# EAGLE design Irrigation Shield v3 (EAGLE 6.4)
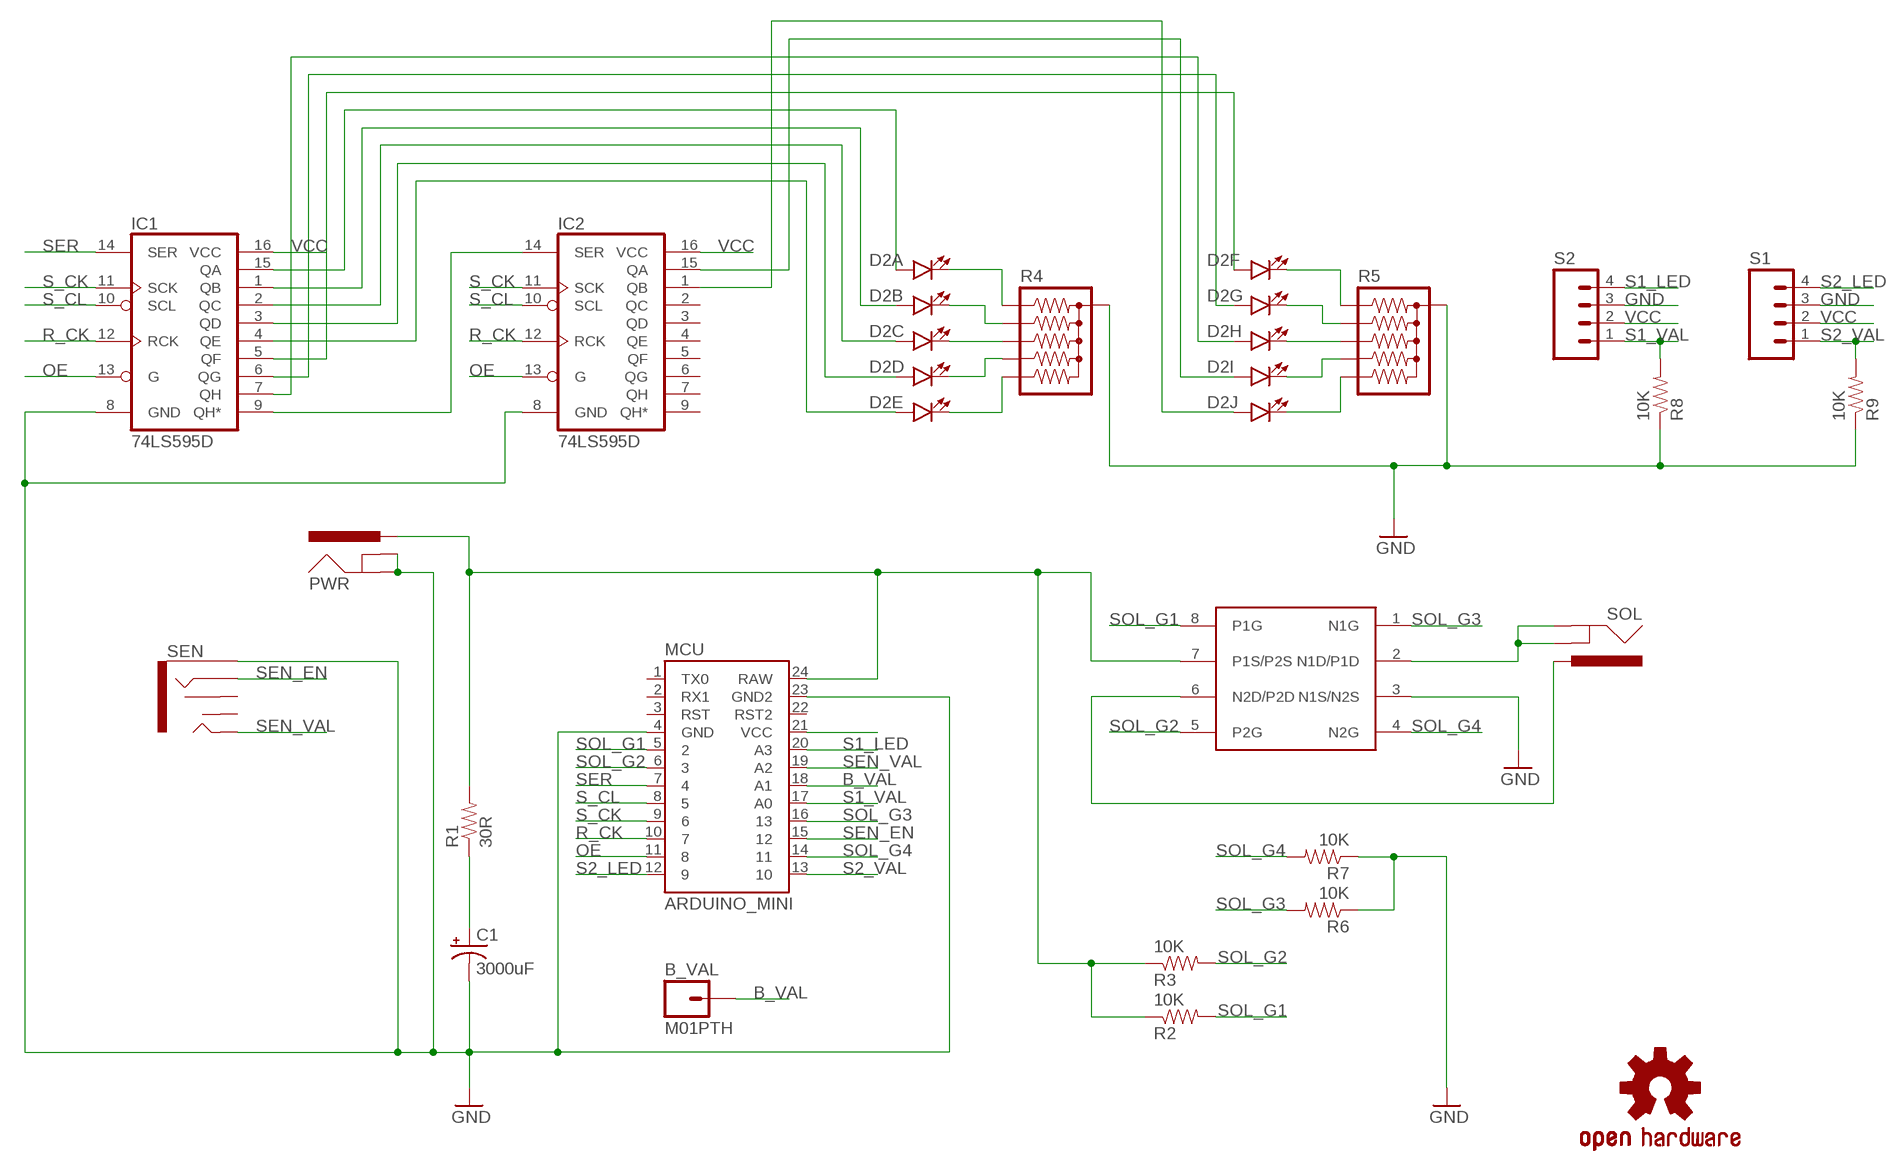
[diagram p0: schematic, sheet 1]

## Parts
B_VAL  M01PTH  [1X01]
C1  3000uF  CAP_POLPTH3  [CPOL-RADIAL-1000UF-63V]
D2  LED_BARGRAPH_10  [LED_BARGAPH_10]
IC1  74LS595D  [SO16]
IC2  74LS595D  [SO16]
LOGO1  OSHW-LOGOL  [OSHW-LOGO-L]
MCU  ARDUINO_MINI  [ARDUINO_MINI]
PWR  POWER_JACKPTH  [POWER_JACK_PTH]
R1  30R  RESISTOR0603-RES  [0603-RES]
R2  10K  RESISTOR0603-RES  [0603-RES]
R3  10K  RESISTOR0603-RES  [0603-RES]
R4  RPACK-BUSSED-SIP-PTH-5  [RPACK-SIP-PTH-5]
R5  RPACK-BUSSED-SIP-PTH-5  [RPACK-SIP-PTH-5]
R6  10K  RESISTOR0603-RES  [0603-RES]
R7  10K  RESISTOR0603-RES  [0603-RES]
R8  10K  RESISTOR0603-RES  [0603-RES]
R9  10K  RESISTOR0603-RES  [0603-RES]
S1  M04PTH  [1X04]
S2  M04PTH  [1X04]
SEN  AUDIO-JACK2PTH  [AUDIO-JACK]
SOL  POWER_JACKPTH  [POWER_JACK_PTH]
U$1  ZXMHC6A07N8  [SO8]

## Nets
B_VAL: B_VAL.1 MCU.18(A1)
GND: C1.2(-) IC1.8(GND) IC2.8(GND) MCU.4(GND) MCU.23(GND2) PWR.GND PWR.GNDBREAK R4.P$1 R5.P$1 R6.1 R7.1 R8.1 R9.1 S1.3 S2.3 SEN.SLEEVE U$1.3(N1S/N2S)
N$1: SOL.GND SOL.GNDBREAK U$1.2(N1D/P1D)
N$2: SOL.PWR U$1.6(N2D/P2D)
N$3: IC1.9(QH*) IC2.14(SER)
N$5: D2.7(G:A) IC1.6(QG)
N$7: MCU.24(RAW) PWR.PWR R1.2 R2.1 R3.1 U$1.7(P1S/P2S)
N$8: C1.1(+) R1.1
N$10: D2.15(F:C) R5.P$2
N$11: D2.14(G:C) R5.P$3
N$12: D2.13(H:C) R5.P$4
N$13: D2.12(I:C) R5.P$5
N$14: D2.11(J:C) R5.P$6
N$15: D2.16(E:C) R4.P$6
N$16: D2.17(D:C) R4.P$5
N$17: D2.18(C:C) R4.P$4
N$18: D2.19(B:C) R4.P$3
N$19: D2.20(A:C) R4.P$2
N$20: D2.1(A:A) IC1.15(QA)
N$21: D2.2(B:A) IC1.1(QB)
N$22: D2.3(C:A) IC1.2(QC)
N$23: D2.4(D:A) IC1.3(QD)
N$24: D2.5(E:A) IC1.4(QE)
N$25: D2.6(F:A) IC1.5(QF)
N$26: D2.8(H:A) IC1.7(QH)
N$27: D2.9(I:A) IC2.15(QA)
N$28: D2.10(J:A) IC2.1(QB)
OE: IC1.13(G) IC2.13(G) MCU.11
R_CK: IC1.12(RCK) IC2.12(RCK) MCU.10
S1_LED: MCU.20(A3) S2.4
S1_VAL: MCU.17(A0) R8.2 S2.1
S2_LED: MCU.12 S1.4
S2_VAL: MCU.13 R9.2 S1.1
S_CK: IC1.11(SCK) IC2.11(SCK) MCU.9
S_CL: IC1.10(SCL) IC2.10(SCL) MCU.8
SEN_EN: MCU.15 SEN.RING
SEN_VAL: MCU.19(A2) SEN.TIP
SER: IC1.14(SER) MCU.7
SOL_G1: MCU.5 R2.2 U$1.8(P1G)
SOL_G2: MCU.6 R3.2 U$1.5(P2G)
SOL_G3: MCU.16 R6.2 U$1.1(N1G)
SOL_G4: MCU.14 R7.2 U$1.4(N2G)
VCC: IC1.16(VCC) IC2.16(VCC) MCU.21(VCC) S1.2 S2.2
Unconnected: IC2.2(QC) IC2.3(QD) IC2.4(QE) IC2.5(QF) IC2.6(QG) IC2.7(QH) IC2.9(QH*) MCU.1(TX0) MCU.2(RX1) MCU.3(RST) MCU.22(RST2) SEN.RSH SEN.TSH

## Library data of the parts
B_VAL = SparkFun-Connectors:M01: Header 1 Standard 1-pin 0.1" header. Use with straight break away headers (SKU : PRT-00116), right angle break away headers (PRT-00553), swiss pins (PRT-00743), machine pins (PRT-00117), and female headers (PRT-00115).
C1 = SparkFun-Capacitors:CAP_POL: Capacitor Polarized These are standard SMD and PTH capacitors. Normally 10uF, 47uF, and 100uF in electrolytic and tantalum varieties. Always verify the external diameter of the through hole cap, it varies with capacity, voltage, and manufacturer. The EIA devices should be standard.
D2 = SparkFun-LED:LED_BARGRAPH_10: 10-Segment LED Bar Graph SFE part numbers: COM-09935 (red, Vf = 2.1V, Ifmax = 20mA) COM-09936 (yellow, Vf = 2.1V, Ifmax = 20mA) COM-09937 (blue, Vf = 3.4V, Ifmax = 20mA) COM-09938 (green, Vf = 3.4V, Ifmax = 20mA)
IC1 IC2 = SparkFun-DigitalIC:74*595: 8-bit SHIFT REGISTER, output latch
LOGO1 = SparkFun-Aesthetics:OSHW-LOGO: Open Source Hardware Logo This logo indicates the piece of hardware it is found on incorporates a OSHW license and/or adheres to the definition of open source hardware found here: http://freedomdefined.org/OSHW
MCU = SparkFun-Boards:ARDUINO_MINI: Arduino Pro Mini footprint
PWR = SparkFun-Connectors:POWER_JACK: Power Jack This is the standard 5.5mm barrel jack for power. The PTH is the most common, proven, reliable, footprint. The Slot footprint only works if the mill layer is transmitted to the PCB fab house so be warned. Spark Fun Electronics SKU : PRT-00119 SMT: CONN-08106 Mating wall wart : TOL-00298 (and others)
R1-R3 R6-R9 = SparkFun-Resistors:RESISTOR: Resistor Basic schematic elements and footprints for 0603, 1206, and PTH resistors.
R4 R5 = SparkFun-Resistors:RPACK: BOURNS 4600X series thick-film SIP resistor packs Five resistors bussed to a single pin (denoted by dot). 0.2W / resistor datasheet <http://dlnmh9ip6v2uc.cloudfront.net/datasheets/Components/General/4600x.pdf> SFE parts COM-10855 (330), COM-10856 (10K)
S1 S2 = SparkFun-Connectors:M04: Header 4 Standard 4-pin 0.1" header. Use with straight break away headers (SKU : PRT-00116), right angle break away headers (PRT-00553), swiss pins (PRT-00743), machine pins (PRT-00117), and female headers (PRT-00115). Molex polarized connector foot print use with SKU : PRT-08231 with associated crimp pins and housings. 1MM SMD Version SKU: PRT-10208
SEN = SparkFun-Connectors:AUDIO-JACK2: Stereo audio jack with bypass switches. Used on LilyPad MP3 board. Production SKU: CONN-10353
SOL = SparkFun:POWER_JACK: Power Jack This is the standard 5.5mm barrel jack for power. The PTH is the most common, proven, reliable, footprint. All others are experimental. The Slot footprint only works if the mill layer is transmitted to the PCB fab house so be warned. Spark Fun Electronics SKU : PRT-00119. Mating wall wart : TOL-00298 (and others)
U$1 = Hbridge2:ZXMHC6A07N8

## Board
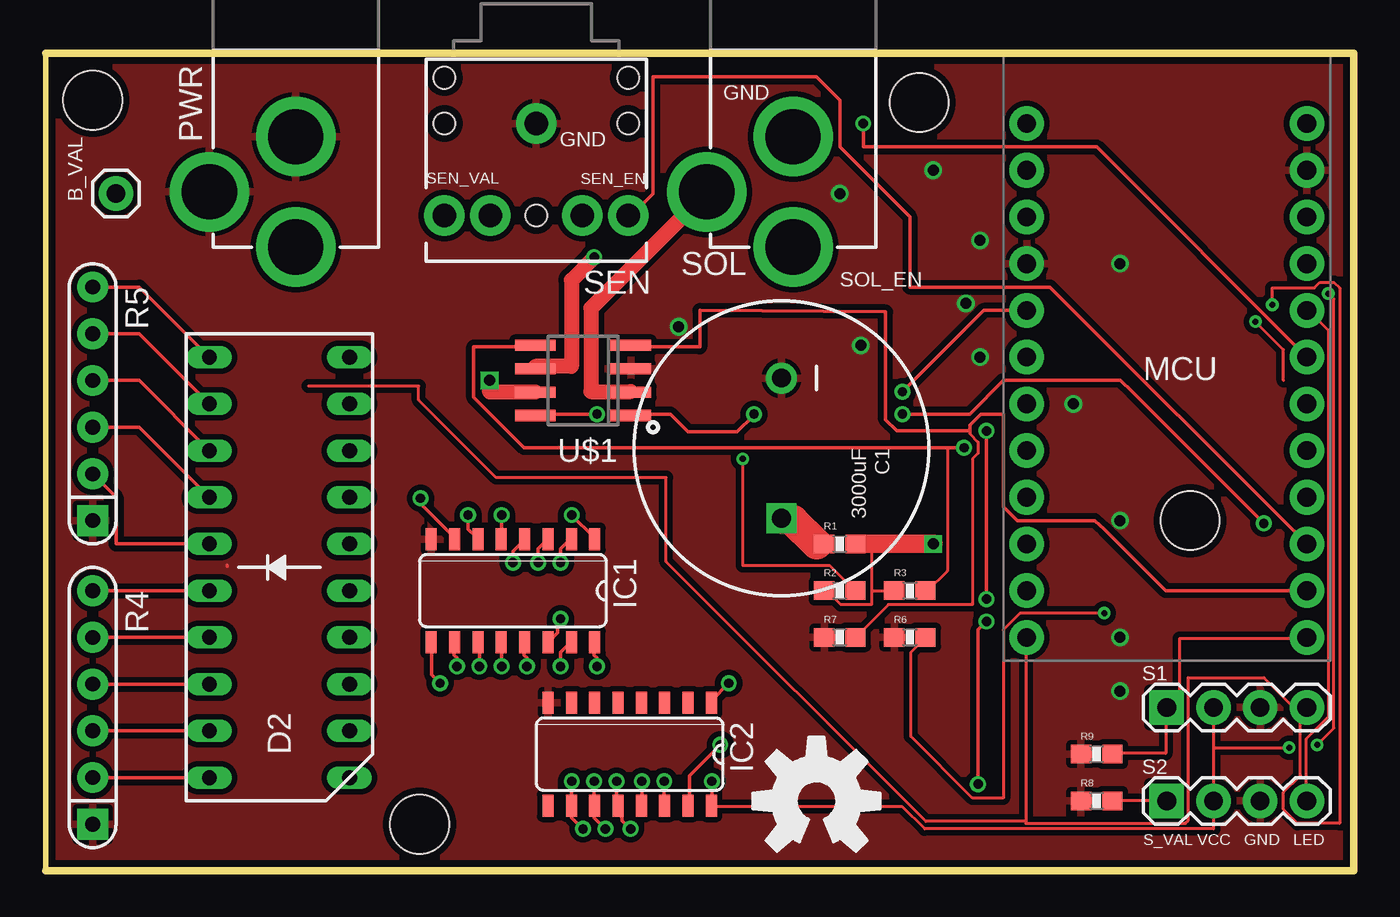
[diagram p1: board, top side]
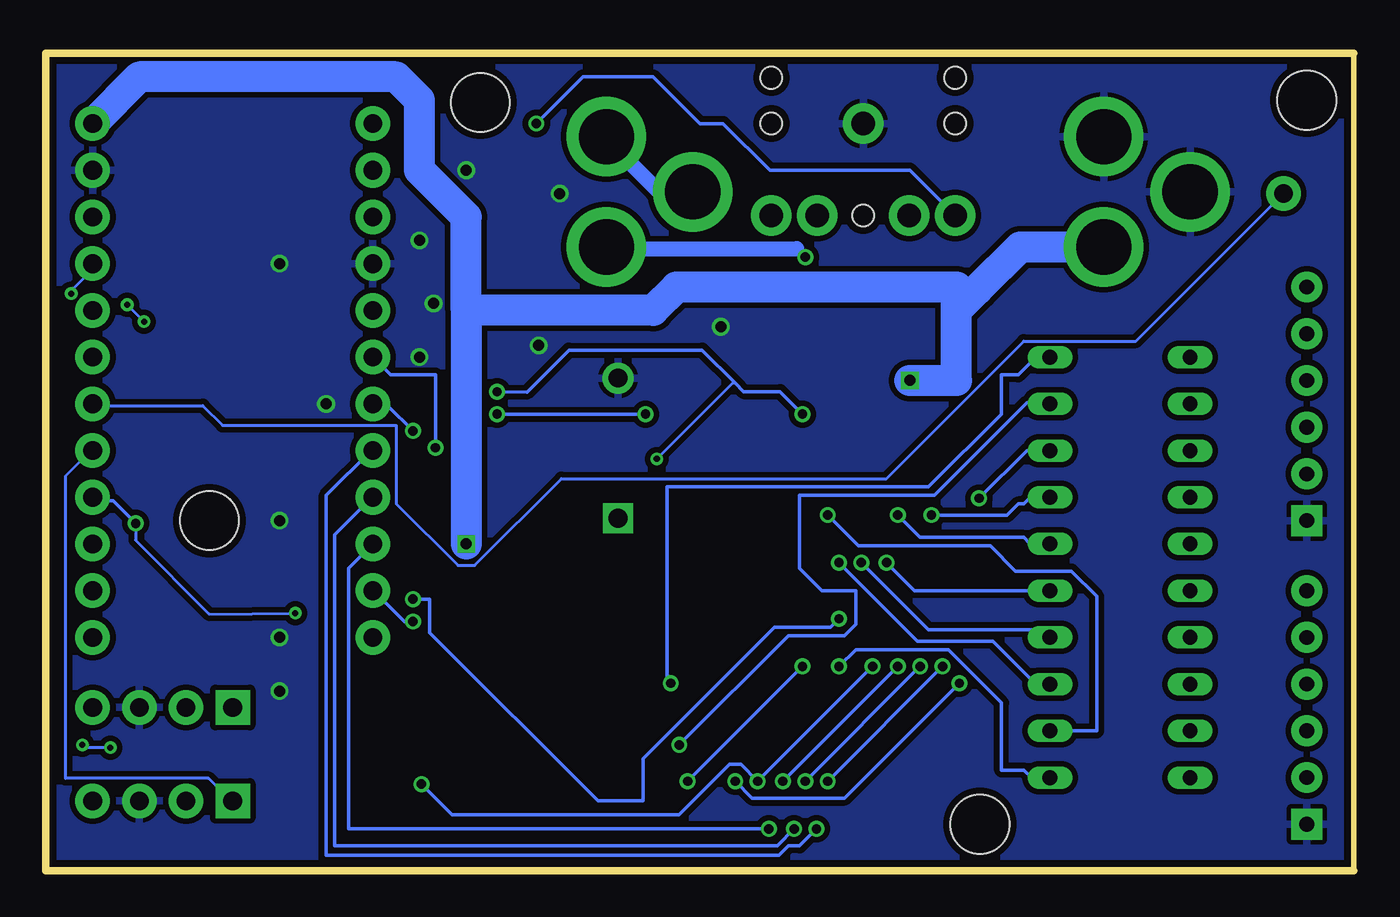
[diagram p2: board, bottom side, seen from below]

Size 71.12 x 44.45 mm. Coordinates in mm from the lower left corner, seen from the top.
Outline: 0,0 0,44.45 71.12,44.45 71.12,0 0,0
Copper layers (1*16): Top 0.0356mm / dielectric 1.5011mm / Bottom 0.0356mm
Design rules "LaenPCBOrder *": minimum track width 6mil, minimum drill 13mil, track to track 6mil, track to pad 6mil, pad to pad 6mil, via to via 6mil, smd to smd 6mil, copper to edge 15mil, drill to drill 6mil, minimum pad ring 7mil, minimum via ring 7mil, stop-mask expansion 3mil, vias tented up to drill 25mil, thermal gap 10mil
Holes 3.2 mm at 47.5,41.78 62.23,19.05 2.54,41.91 20.32,2.54

### Footprints (pad centres in the part's own frame; a part is rotated, then mirrored left to right if it is on the bottom)
1X01 = drill 1.016 pad 1.88: 1 0,0
CPOL-RADIAL-1000UF-63V = drill 1.016 pad 1.651 square: 1 3.81,0 | drill 1.016 pad 1.676: 2 -3.81,0
LED_BARGAPH_10 = drill 0.813 long: 1 -11.43,-3.81; 2 -8.89,-3.81; 3 -6.35,-3.81; 4 -3.81,-3.81; 5 -1.27,-3.81; 6 1.27,-3.81; 7 3.81,-3.81; 8 6.35,-3.81; 9 8.89,-3.81; 10 11.43,-3.81; 11 11.43,3.81; 12 8.89,3.81; 13 6.35,3.81; 14 3.81,3.81; 15 1.27,3.81; 16 -1.27,3.81; 17 -3.81,3.81; 18 -6.35,3.81; 19 -8.89,3.81; 20 -11.43,3.81
SO16 = smd 0.6 x 1.2: 1 -4.445,-2.8; 2 -3.175,-2.8; 3 -1.905,-2.8; 4 -0.635,-2.8; 5 0.635,-2.8; 6 1.905,-2.8; 7 3.175,-2.8; 8 4.445,-2.8; 9 4.445,2.8; 10 3.175,2.8; 11 1.905,2.8; 12 0.635,2.8; 13 -0.635,2.8; 14 -1.905,2.8; 15 -3.175,2.8; 16 -4.445,2.8
ARDUINO_MINI = drill 1.016 pad 1.88: 1 -7.62,12.7; 2 -7.62,10.16; 3 -7.62,7.62; 4 -7.62,5.08; 5 -7.62,2.54; 6 -7.62,0; 7 -7.62,-2.54; 8 -7.62,-5.08; 9 -7.62,-7.62; 10 -7.62,-10.16; 11 -7.62,-12.7; 12 -7.62,-15.24; 13 7.62,-15.24; 14 7.62,-12.7; 15 7.62,-10.16; 16 7.62,-7.62; 17 7.62,-5.08; 18 7.62,-2.54; 19 7.62,0; 20 7.62,2.54; 21 7.62,5.08; 22 7.62,7.62; 23 7.62,10.16; 24 7.62,12.7
POWER_JACK_PTH = drill 2.997 pad 4.318: GND 0,7.7; GNDBREAK 4.7,10.7; PWR 0,13.7
0603-RES = smd 1.1 x 1: 1 -0.85,0; 2 0.85,0
RPACK-SIP-PTH-5 = drill 0.8 pad 1.676 square: P$1 0,0 | drill 0.8 pad 1.676: P$2 0,-2.54; P$3 0,-5.08; P$4 0,-7.62; P$5 0,-10.16; P$6 0,-12.7
1X04 = drill 1.016 pad 1.88 square: 1 0,0 | drill 1.016 pad 1.88: 2 2.54,0; 3 5.08,0; 4 7.62,0
AUDIO-JACK = drill 1.3 pad 2.184: RING 5,5; RSH 5,2.5; SLEEVE 0,0; TIP 5,-5; TSH 5,-2.5 | hole 1.2: 0,5; -2.5,5; -2.5,-5; 0,-5; 5,0
SO8 = smd 0.6 x 2.2: 1 -1.905,-2.6; 2 -0.635,-2.6; 3 0.635,-2.6; 4 1.905,-2.6; 5 1.905,2.6; 6 0.635,2.6; 7 -0.635,2.6; 8 -1.905,2.6

### Placement (x,y rotation side)
B_VAL  3.81,36.83 0 top
C1  40,22.99 270 top
D2  12.7,16.51 90 top
IC1  25.4,15.24 180 top
IC2  31.75,6.35 180 top
LOGO1  41.91,3.81 0 top
MCU  60.96,27.94 0 top
PWR  13.59,47.63 180 top
R1  43.18,17.78 0 top
R2  43.18,15.24 0 top
R3  46.99,15.24 0 top
R4  2.54,2.54 180 top
R5  2.54,19.05 180 top
R6  46.99,12.7 0 top
R7  43.18,12.7 0 top
R8  57.15,3.81 0 top
R9  57.15,6.35 0 top
S1  60.96,8.89 0 top
S2  60.96,3.81 0 top
SEN  26.67,40.64 270 top
SOL  40.64,47.63 180 top
U$1  29.21,26.67 90 top

### Tracks (layer width: path | path; a pad name or v marks a point on that pad's centre or on a via)
B_VAL
  Bottom 0.152: B_VAL.1 11.84,28.8 17.93,28.8 25.4,21.34 43.08,21.34 47.8,16.61 48.72,16.61 52.07,19.96 52.07,24.23 61.52,24.23 62.59,25.3 68.53,25.3 MCU.18
GND  (via drill 0.6)
  Top 0.152: C1.2 40.03,26.82 39.95,26.85
  Top 0.203: 9.85,16.61 9.84,16.56
  other vias: 50.8,27.94 58.42,33.02 58.42,19.05 48.26,38.1 50.8,34.29 34.42,29.59 50.04,30.86 43.18,36.83 58.42,12.7 58.42,9.78 55.88,25.4 44.32,28.58
  pour Bottom (isolate 0.305): 0,0 71.12,0 71.12,44.45 0,44.45
  pour Top (isolate 0.305): 0,0 0,44.45 71.12,44.45 71.12,0
N$1
  Top 0.203: 31.8,26.06 U$1.2 | 35.92,36.88 SOL.GNDBREAK
  Top 0.813: 31.8,26.06 29.64,26.06 29.64,30.61 35.92,36.88
  Bottom 0.203: 40.64,39.78 SOL.GND | 36.07,37.03 SOL.GNDBREAK
  Bottom 0.813: 40.64,39.78 37.9,37.03 36.07,37.03
N$2  (via drill 0.51)
  Top 0.203: 26.62,27.43 U$1.6
  Top 0.813: 26.62,27.43 28.57,27.43 28.57,32.13 v29.82,33.38
  Bottom 0.203: 30.28,33.83 v29.82,33.38 | 40.64,33.83 SOL.PWR
  Bottom 0.813: 40.64,33.83 30.28,33.83
N$3  (via drill 0.51)
  Top 0.203: v21.44,10.21 20.98,10.67 20.98,12.34 IC1.9 | v33.63,4.88 33.63,3.66 IC2.14
  Bottom 0.203: v21.44,10.21 27.69,3.96 32.72,3.96 v33.63,4.88
N$5  (via drill 0.51)
  Top 0.203: v22.96,19.36 22.96,18.59 23.42,18.14 IC1.6
  Bottom 0.203: v22.96,19.36 18.85,19.36 18.24,19.96 17.93,19.96 17.63,20.27 16.56,20.27 D2.7
N$7  (via drill 0.6)
  Top 0.152: 44.91,17.78 44.91,15.24 | 44.91,15.24 44.91,14.48 43.23,14.48 42.47,15.24 R2.1 | 44.91,15.24 R3.1
  Top 0.813: U$1.7 24.13,26.04 v24.13,26.67
  Top 1.016: v48.26,17.78 44.91,17.78 R1.2
  Bottom 0.203: 20.45,31.62 20.98,32.16 21.59,31.75
  Bottom 1.676: PWR.PWR 18.14,33.93 20.45,31.62 21.59,30.48 | 48.26,30.48 38.1,30.48 36.83,31.75 21.59,31.75 21.59,26.67 v24.13,26.67 | 48.26,30.48 48.26,35.56 50.8,38.1 50.8,41.91 52.07,43.18 66.04,43.18 MCU.24 | 48.26,30.48 v48.26,17.78
N$8
  Top 1.016: R1.1 41.91,17.78
  Top 1.676: 41.91,17.78 40.64,19.05 C1.1
N$10
  Top 0.203: D2.15 3.81,17.78 3.81,20.32 R5.P$2
N$11
  Top 0.203: D2.14 5.08,24.13 R5.P$3
N$12
  Top 0.203: D2.13 5.08,26.67 R5.P$4
N$13
  Top 0.203: D2.12 5.08,29.21 R5.P$5
N$14
  Top 0.203: D2.11 5.08,31.75 R5.P$6
N$15
  Top 0.203: R4.P$6 D2.16
N$16
  Top 0.203: R4.P$5 D2.17
N$17
  Top 0.203: R4.P$4 D2.18
N$18
  Top 0.203: R4.P$3 D2.19
N$19
  Top 0.203: R4.P$2 D2.20
N$20  (via drill 0.51)
  Top 0.203: v27.99,11.12 27.99,11.89 28.45,12.34 IC1.15
  Bottom 0.203: v27.99,11.12 27.08,12.04 22.05,12.04 19.15,9.14 19.15,5.49 17.93,5.49 17.47,5.03 16.56,5.03 D2.1
N$21  (via drill 0.51)
  Top 0.203: v28.6,19.36 29.82,18.14 IC1.1
  Bottom 0.203: v28.6,19.36 26.92,17.68 19.76,17.68 18.39,16.31 15.34,16.31 13.97,14.94 13.97,7.62 D2.2
N$22  (via drill 0.51)
  Top 0.203: v27.99,16.76 27.99,17.53 28.45,17.98 IC1.2
  Bottom 0.203: v27.99,16.76 23.72,12.5 19.61,12.5 17.32,10.21 16.56,10.21 D2.3
N$23  (via drill 0.51)
  Top 0.203: v26.77,16.76 26.77,17.53 27.23,17.98 IC1.3
  Bottom 0.203: v26.77,16.76 23.11,13.11 16.87,13.11 16.56,12.8 D2.4
N$24  (via drill 0.51)
  Top 0.203: v25.4,16.76 25.4,17.37 26.01,17.98 IC1.4
  Bottom 0.203: v25.4,16.76 23.88,15.24 D2.5
N$25  (via drill 0.51)
  Top 0.203: v24.79,19.36 24.79,18.14 IC1.5
  Bottom 0.203: v24.79,19.36 23.57,18.14 17.93,18.14 17.63,17.83 16.56,17.83 D2.6
N$26  (via drill 0.51)
  Top 0.203: v20.37,20.27 20.37,19.96 22.2,18.14 IC1.7
  Bottom 0.203: v20.37,20.27 17.78,22.86 D2.8
N$27  (via drill 0.51)
  Top 0.203: v36.68,6.86 35,5.18 35,3.66 IC2.15
  Bottom 0.203: v36.68,6.86 30.73,12.8 27.69,12.8 27.08,13.41 27.08,15.24 28.9,15.24 30.12,16.46 30.12,20.42 22.81,20.42 17.78,25.45 16.56,25.45 D2.9
N$28  (via drill 0.51)
  Top 0.203: v37.14,10.21 36.22,9.3 IC2.1
  Bottom 0.203: v37.14,10.21 37.34,10.41 37.34,20.88 23.11,20.88 19.15,24.84 19.15,26.98 18.24,26.98 17.32,27.89 16.56,27.89 D2.10
OE  (via drill 0.51)
  Top 0.203: v32.41,4.88 32.41,3.66 IC2.13 | v26.16,11.12 26.16,11.58 26.01,11.73 26.01,12.34 IC1.13 | v51.16,13.56 50.7,13.11 v50.7,4.72
  Bottom 0.203: v26.16,11.12 v32.41,4.88 33.33,5.79 33.93,5.79 36.68,3.05 49.02,3.05 v50.7,4.72 | v51.16,13.56 51.61,13.56 53.29,15.24 MCU.11
R_CK  (via drill 0.51)
  Top 0.203: v31.04,4.88 31.04,3.66 IC2.12 31.19,3.51 31.19,3.05 31.34,2.9 31.34,2.74 v31.8,2.29 | v24.79,11.12 24.79,12.34 IC1.12
  Bottom 0.203: v24.79,11.12 v31.04,4.88 | MCU.10 54.66,16.46 54.66,2.29 v31.8,2.29
S1_LED
  Top 0.152: S2.4 68.53,3.81 68.53,7.16 69.75,8.38 69.75,29.41 68.68,30.48 MCU.20
S1_VAL
  Top 0.152: S2.1 R8.2
  Bottom 0.152: MCU.17 68.68,22.86 70.05,21.49 70.05,5.03 62.28,5.03 61.06,3.81 S2.1
S2_LED  (via drill 0.33)
  Top 0.152: 68.22,8.53 68.22,5.18 67.31,4.27 67.31,3.35 68.07,2.59 70.36,2.59 70.36,31.7 70.05,32 69.29,32 68.99,31.7 66.7,31.7 v66.7,30.79 | v65.79,29.87 67.31,28.35 67.31,26.67 | 14.27,26.37 20.27,26.37 20.27,25.6 24.49,21.39 33.73,21.39 33.73,16.81 47.85,2.69 53.29,2.69 | 53.29,2.69 53.29,12.65 MCU.12 | 68.22,8.53 66.24,10.52 62.13,10.52 62.13,2.74 61.98,2.59 53.29,2.59 53.29,2.69 | 68.22,8.53 S1.4
  Bottom 0.152: v65.79,29.87 v66.7,30.79
S2_VAL
  Top 0.152: MCU.13 68.53,12.65 61.67,12.65 61.67,9.6 S1.1 60.91,8.84 60.91,6.4 58.01,6.4 R9.2
S_CK  (via drill 0.51)
  Top 0.203: v29.82,4.88 29.82,3.66 IC2.11 29.82,3.51 29.82,2.9 v30.43,2.29 | v23.57,11.12 23.57,12.34 IC1.11
  Bottom 0.203: v23.57,11.12 v29.82,4.88 | v30.43,2.29 31.34,1.37 55.42,1.37 55.42,18.29 53.44,20.27 MCU.9
S_CL  (via drill 0.51)
  Top 0.203: v28.6,4.88 28.6,3.66 IC2.10 28.6,3.51 28.6,2.9 v29.21,2.29 | v22.35,11.12 22.35,11.58 22.2,11.73 22.2,12.34 IC1.10
  Bottom 0.203: v22.35,11.12 v28.6,4.88 | v29.21,2.29 30.12,1.37 30.73,1.37 31.24,0.86 55.88,0.86 55.88,20.42 53.44,22.86 MCU.8
SEN_EN
  Top 0.203: MCU.15 54.61,31.75 46.99,31.75 46.99,35.56 43.18,39.37 43.18,41.91 41.91,43.18 33.02,43.18 33.02,36.83 31.75,35.56 SEN.RING
SEN_VAL  (via drill 0.51)
  Top 0.203: MCU.19 57.15,39.37 44.45,39.37 v44.45,40.64
  Bottom 0.203: v44.45,40.64 41.91,43.18 38.1,43.18 35.56,40.64 34.29,40.64 31.75,38.1 24.13,38.1 SEN.TIP 21.59,35.56
SER  (via drill 0.51)
  Top 0.203: v27.99,13.72 27.84,13.56 27.84,12.95 27.38,12.5 IC1.14 | v51.16,23.93 v51.16,14.78
  Bottom 0.203: v27.99,13.72 28.45,13.26 31.5,13.26 38.66,6.1 38.66,3.81 41.1,3.81 50.24,12.95 50.24,14.78 v51.16,14.78 | v51.16,23.93 52.53,25.3 53.29,25.3 MCU.7
SOL_G1  (via drill 0.33, 0.51)
  Top 0.152: v37.9,22.4 37.9,16.61 42.62,16.61 43.99,15.24 R2.2
  Top 0.203: v29.97,24.84 26.62,24.84 U$1.8 | v46.58,26.06 51,30.48 MCU.5
  Bottom 0.152: v37.9,22.4 33.78,26.52 33.63,26.52
  Bottom 0.203: v29.97,24.84 31.19,26.06 33.17,26.06 33.63,26.52 35.43,28.32 42.67,28.32 44.96,26.04 v46.58,26.06
SOL_G2  (via drill 0.51)
  Top 0.152: 49.02,23.01 49.02,16.31 47.95,15.24 R3.2
  Top 0.203: v49.94,23.01 49.02,23.01 26.01,23.01 23.27,25.76 23.27,28.5 26.47,28.5 U$1.5
  Bottom 0.203: v49.94,23.01 49.94,26.98 52.38,26.98 MCU.6
SOL_G3  (via drill 0.33, 0.51)
  Top 0.152: v57.56,14.02 52.98,14.02 52.07,13.11 52.07,3.96 50.39,3.96 47.04,7.31 47.04,11.89 47.8,12.65 R6.2
  Top 0.203: v38.51,24.84 38.48,24.77 37.59,23.88 34.92,23.88 33.96,24.84 31.95,24.84 U$1.1 | v46.58,24.84 50.24,24.84 52.07,26.67 58.44,26.67 59.08,26.06 v66.24,18.9
  Bottom 0.152: v66.24,18.9 66.24,17.98 62.23,13.97 v57.56,14.02
  Bottom 0.203: v46.58,24.84 v38.51,24.84 | v66.24,18.9 67.46,20.12 68.38,20.12 MCU.16
SOL_G4
  Top 0.152: 50.24,23.93 50.24,23.77 50.7,23.32 50.7,22.71 50.39,22.4 50.39,14.48 45.82,14.48 44.14,12.8 R7.2
  Top 0.203: MCU.14 60.91,15.24 57.56,18.59 57.05,19.05 52.83,19.05 52.07,19.81 52.07,24.84 50.85,24.84 50.24,24.23 50.24,23.93 46.28,23.93 45.67,24.54 45.67,30.4 35.56,30.48 35.56,28.5 31.95,28.5 U$1.4
VCC  (via drill 0.33, 0.51)
  Top 0.152: S1.2 63.5,6.71 | 63.5,6.71 S2.2 63.5,2.29 47.8,2.29 46.58,3.51 36.22,3.51 IC2.16 | v69.75,31.39 70.05,31.09 70.05,7.77 v69.14,6.86 | 63.5,6.71 v67.61,6.71
  Top 0.203: v36.22,4.88 36.22,3.66 IC2.16 | v29.97,11.12 29.97,11.58 29.82,11.73 29.82,12.34 IC1.16
  Bottom 0.152: v69.75,31.39 69.75,31.55 68.99,32.31 68.68,32.31 68.68,32.92 MCU.21 | v69.14,6.86 68.99,6.71 v67.61,6.71
  Bottom 0.203: v29.97,11.12 v36.22,4.88

### Text on the board
tPlace: GND | GND | SEN_VAL | SEN_EN | SOL_EN
tNames: S_VAL | VCC | GND | LED